# EAGLE design ETH-IO_v3.1 (EAGLE 9.6.2)
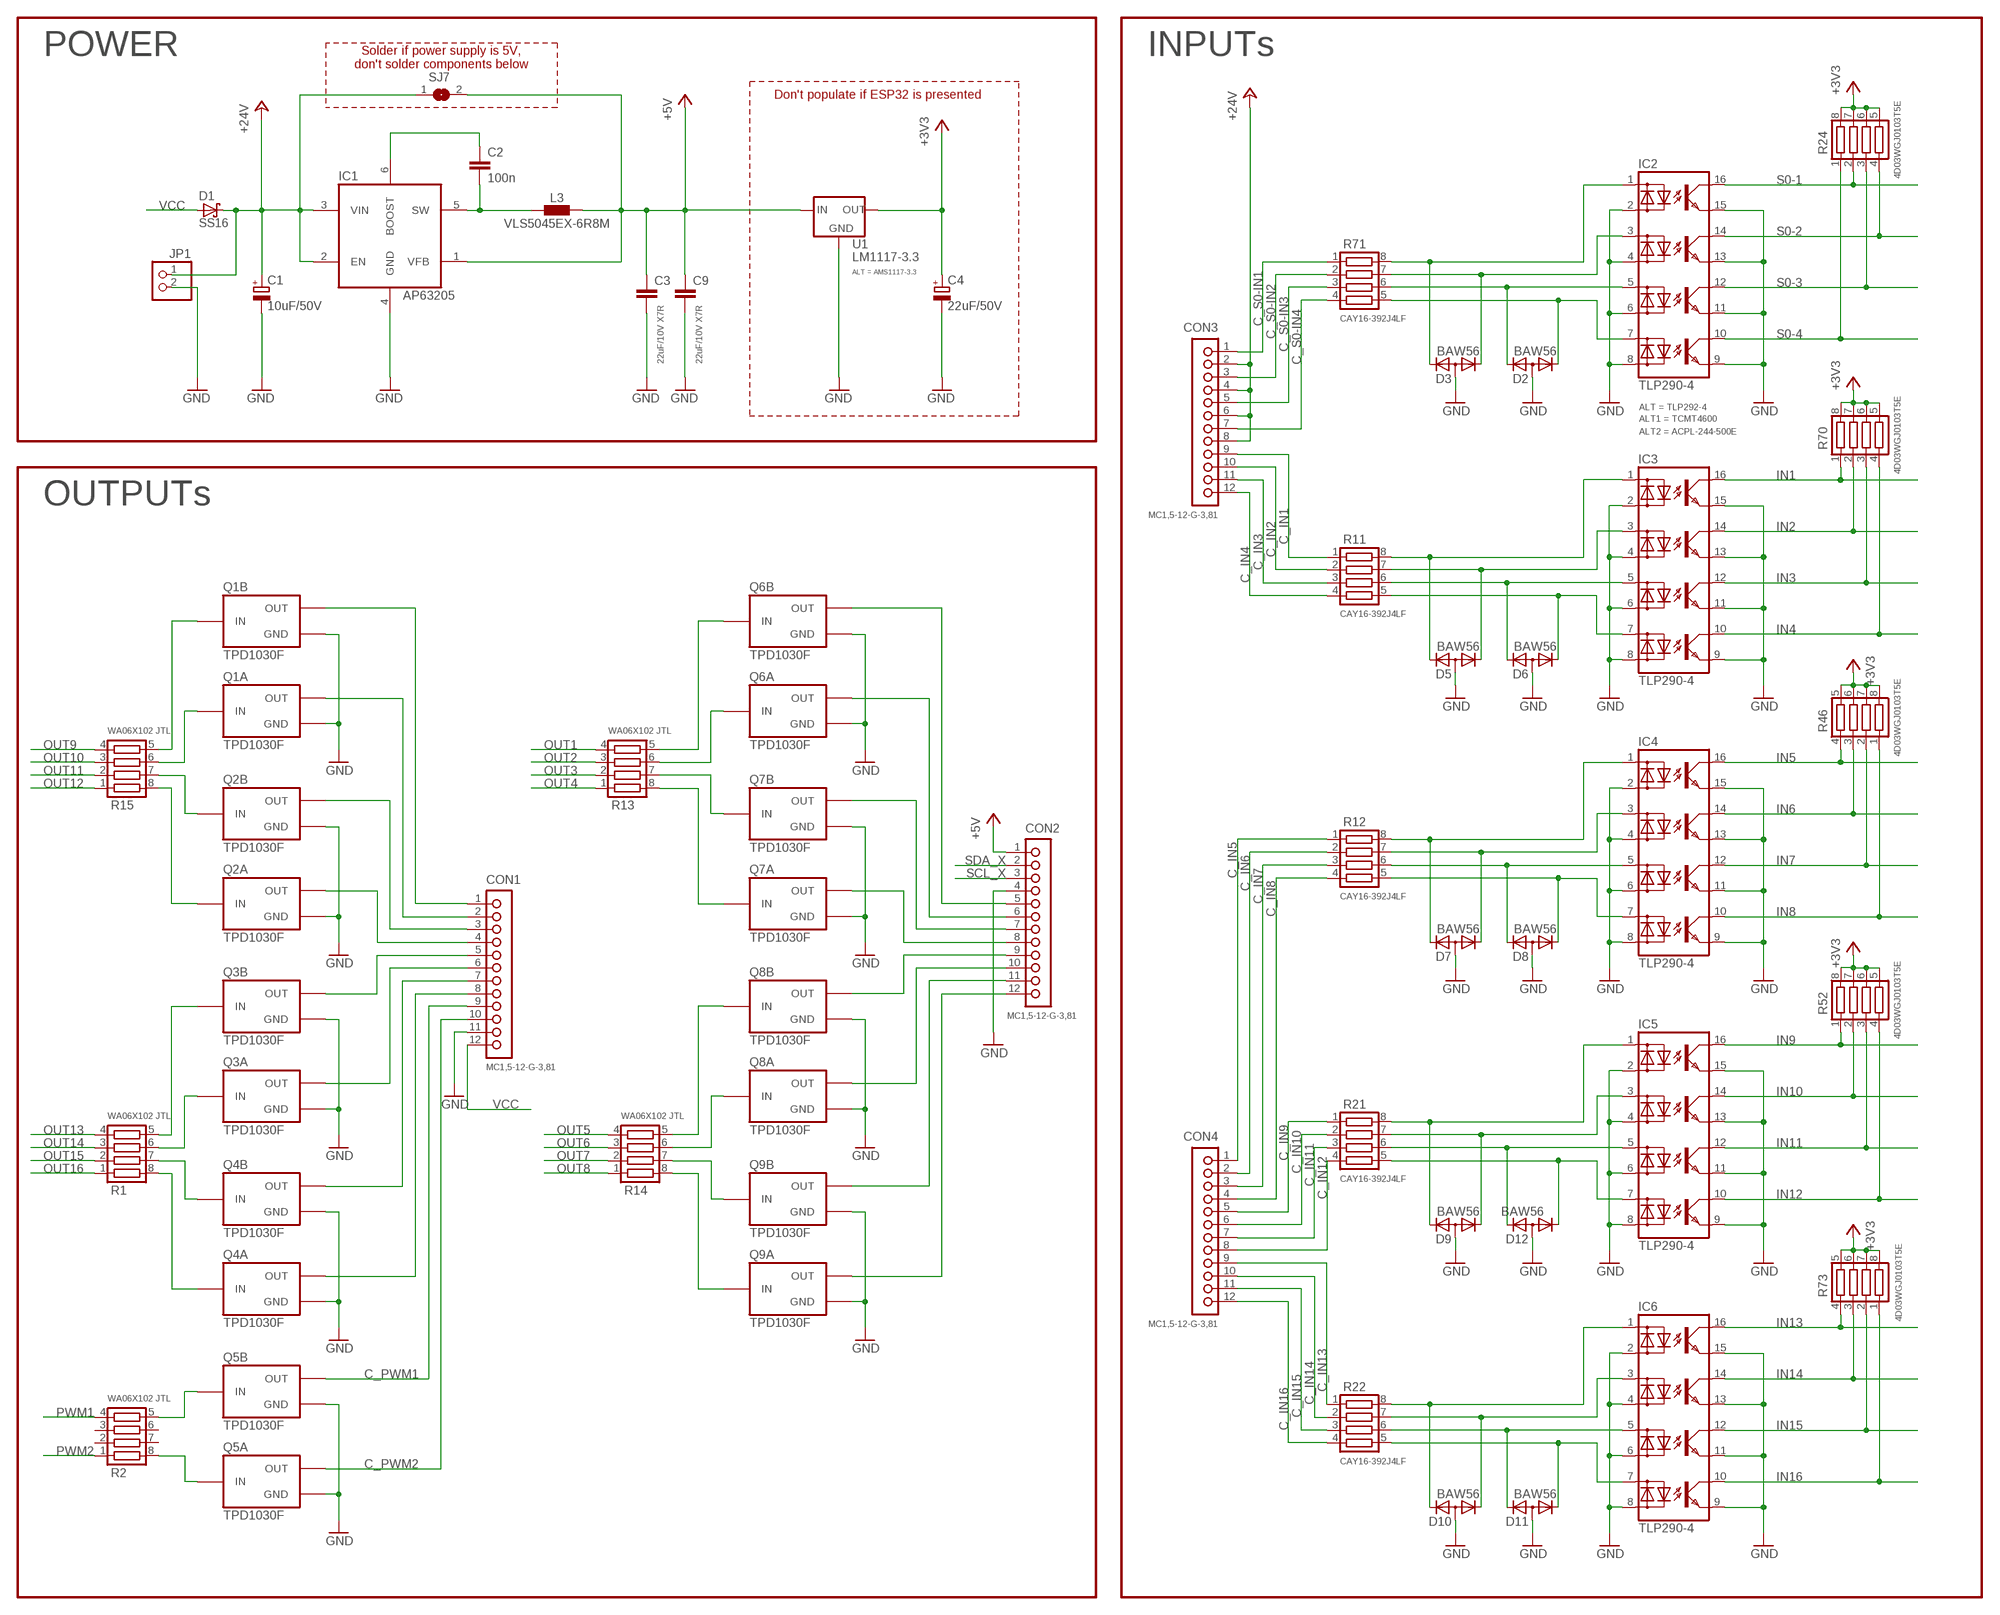
[diagram p0: schematic, sheet 1, part 1 of 2]
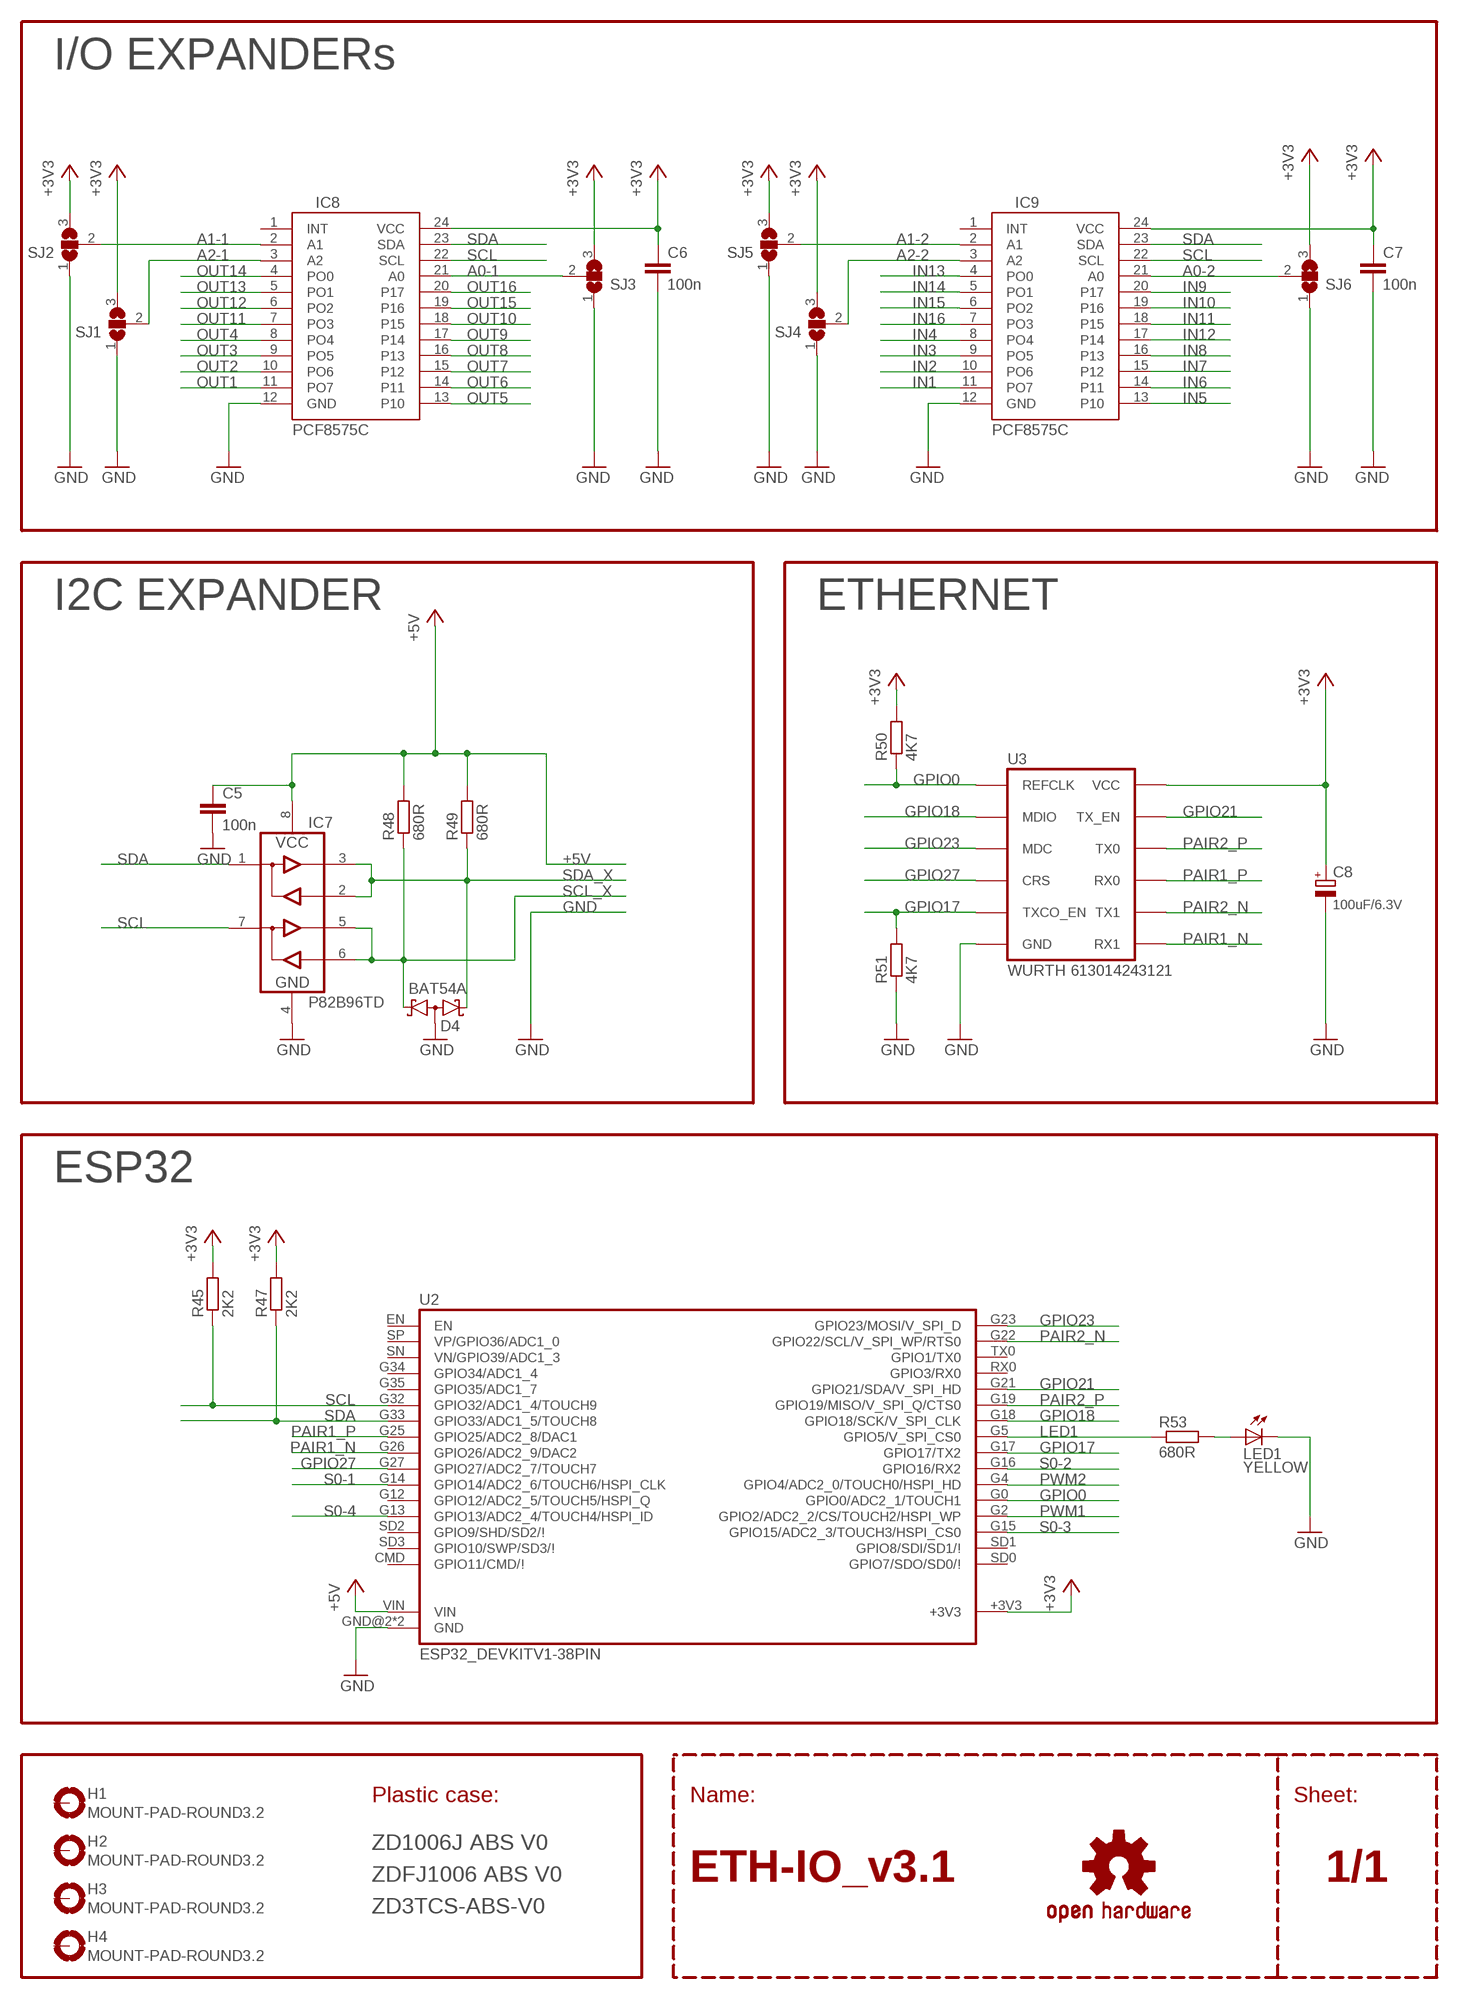
[diagram p1: schematic, sheet 1, part 2 of 2]

## Parts
C1  10uF/50V  CPOL-EUC  [PANASONIC_C]
C2  100n  C-EUC0805  [C0805]
C3  22uF/10V X7R  C-EUC1206  [C1206]
C4  22uF/50V  CPOL-EUC  [PANASONIC_C]
C5  100n  C-EUC0805  [C0805]
C6  100n  C-EUC0805  [C0805]
C7  100n  C-EUC0805  [C0805]
C8  100uF/6.3V  CPOL-EUC  [PANASONIC_C]
C9  22uF/10V X7R  C-EUC1206  [C1206]
CON1  MC1,5-12-G-3,81  [MC1,5/12-G-3,81]
CON2  MC1,5-12-G-3,81  [MC1,5/12-G-3,81]
CON3  MC1,5-12-G-3,81  [MC1,5/12-G-3,81]
CON4  MC1,5-12-G-3,81  [MC1,5/12-G-3,81]
D1  SS16  [DO214AC]
D2  BAW56  [SOT23]
D3  BAW56  [SOT23]
D4  BAT54A  [SOT23]
D5  BAW56  [SOT23]
D6  BAW56  [SOT23]
D7  BAW56  [SOT23]
D8  BAW56  [SOT23]
D9  BAW56  [SOT23]
D10  BAW56  [SOT23]
D11  BAW56  [SOT23]
D12  BAW56  [SOT23]
H1  MOUNT-PAD-ROUND3.2  [3,2-PAD]
H2  MOUNT-PAD-ROUND3.2  [3,2-PAD]
H3  MOUNT-PAD-ROUND3.2  [3,2-PAD]
H4  MOUNT-PAD-ROUND3.2  [3,2-PAD]
IC1  AP63205  [SOT23-6]
IC2  TLP290-4  [SO16]
IC3  TLP290-4  [SO16]
IC4  TLP290-4  [SO16]
IC5  TLP290-4  [SO16]
IC6  TLP290-4  [SO16]
IC7  P82B96TD  [SO08]
IC8  PCF8575C  [SO-24DW]
IC9  PCF8575C  [SO-24DW]
JP1  PINHD-1X2  [1X02]
L3  VLS5045EX-6R8M  L5045  [L5040-LONGER]
LED1  YELLOW  LED0805  [LED0805]
LOGO1  OSHW-LOGOM-COPPER  [OSHW-LOGO-M_COPPER]
Q1  TPD1030F  BTS3410G  [SO8]
Q2  TPD1030F  BTS3410G  [SO8]
Q3  TPD1030F  BTS3410G  [SO8]
Q4  TPD1030F  BTS3410G  [SO8]
Q5  TPD1030F  BTS3410G  [SO8]
Q6  TPD1030F  BTS3410G  [SO8]
Q7  TPD1030F  BTS3410G  [SO8]
Q8  TPD1030F  BTS3410G  [SO8]
Q9  TPD1030F  BTS3410G  [SO8]
R1  WA06X102 JTL  RESISTOR-ARRAY-1206  [RESCAV80P320X160X60-8N]
R2  WA06X102 JTL  RESISTOR-ARRAY-1206  [RESCAV80P320X160X60-8N]
R11  CAY16-392J4LF  RESISTOR-ARRAY-1206  [RESCAV80P320X160X60-8N]
R12  CAY16-392J4LF  RESISTOR-ARRAY-1206  [RESCAV80P320X160X60-8N]
R13  WA06X102 JTL  RESISTOR-ARRAY-1206  [RESCAV80P320X160X60-8N]
R14  WA06X102 JTL  RESISTOR-ARRAY-1206  [RESCAV80P320X160X60-8N]
R15  WA06X102 JTL  RESISTOR-ARRAY-1206  [RESCAV80P320X160X60-8N]
R21  CAY16-392J4LF  RESISTOR-ARRAY-1206  [RESCAV80P320X160X60-8N]
R22  CAY16-392J4LF  RESISTOR-ARRAY-1206  [RESCAV80P320X160X60-8N]
R24  4D03WGJ0103T5E  RESISTOR-ARRAY-1206  [RESCAV80P320X160X60-8N]
R45  2K2  R-EU_R0805  [R0805]
R46  4D03WGJ0103T5E  RESISTOR-ARRAY-1206  [RESCAV80P320X160X60-8N]
R47  2K2  R-EU_R0805  [R0805]
R48  680R  R-EU_R0805  [R0805]
R49  680R  R-EU_R0805  [R0805]
R50  4K7  R-EU_R0805  [R0805]
R51  4K7  R-EU_R0805  [R0805]
R52  4D03WGJ0103T5E  RESISTOR-ARRAY-1206  [RESCAV80P320X160X60-8N]
R53  680R  R-EU_R0805  [R0805]
R70  4D03WGJ0103T5E  RESISTOR-ARRAY-1206  [RESCAV80P320X160X60-8N]
R71  CAY16-392J4LF  RESISTOR-ARRAY-1206  [RESCAV80P320X160X60-8N]
R73  4D03WGJ0103T5E  RESISTOR-ARRAY-1206  [RESCAV80P320X160X60-8N]
SJ1  SJ2W  [SJ_2]
SJ2  SJ2W  [SJ_2]
SJ3  SJ2W  [SJ_2]
SJ4  SJ2W  [SJ_2]
SJ5  SJ2W  [SJ_2]
SJ6  SJ2W  [SJ_2]
SJ7  SJ  [SJ]
U1  LM1117-3.3  [SOT223]
U2  ESP32_DEVKITV1-38PIN  [ESP32_DEVKITV1_38PIN]
U3  WURTH 613014243121  LAN8720_ETH_BOARD  [LAN8720_ETH_BOARD]

## Nets
+3V3 [PWR]: C4.+ C6.1 C7.1 C8.+ IC8.24(VCC) IC9.24(VCC) R24.5 R24.6 R24.7 R24.8 R45.2 R46.5 R46.6 R46.7 R46.8 R47.2 R50.2 R52.5 R52.6 R52.7 R52.8 R70.5 R70.6 R70.7 R70.8 R73.5 R73.6 R73.7 R73.8 SJ1.3 SJ2.3 SJ3.3 SJ4.3 SJ5.3 SJ6.3 U1.2(OUT) U1.4(OUT) U2.+3V3 U3.VCC U3.VCC@1(VCC)
+5V [PWR]: C3.1 C5.1 C9.1 CON2.1 IC1.1(VFB) IC7.8(VCC) L3.1 R48.2 R49.2 SJ7.2 U1.3(IN) U2.VIN
+24V [PWR]: C1.+ CON3.2 CON3.4 CON3.6 CON3.8 D1.C IC1.2(EN) IC1.3(VIN) JP1.1 SJ7.1
A0-1: IC8.21(A0) SJ3.2
A0-2: IC9.21(A0) SJ6.2
A1-1: IC8.2(A1) SJ2.2
A1-2: IC9.2(A1) SJ5.2
A2-1: IC8.3(A2) SJ1.2
A2-2: IC9.3(A2) SJ4.2
C_IN1: CON3.9 R11.1
C_IN2: CON3.10 R11.2
C_IN3: CON3.11 R11.3
C_IN4: CON3.12 R11.4
C_IN5: CON4.1 R12.1
C_IN6: CON4.2 R12.2
C_IN7: CON4.3 R12.3
C_IN8: CON4.4 R12.4
C_IN9: CON4.5 R21.1
C_IN10: CON4.6 R21.2
C_IN11: CON4.7 R21.3
C_IN12: CON4.8 R21.4
C_IN13: CON4.9 R22.1
C_IN14: CON4.10 R22.2
C_IN15: CON4.11 R22.3
C_IN16: CON4.12 R22.4
C_OUT1: CON2.5 Q6.5(B:OUT) Q6.6(B:OUT)
C_OUT2: CON2.6 Q6.7(A:OUT) Q6.8(A:OUT)
C_OUT3: CON2.7 Q7.5(B:OUT) Q7.6(B:OUT)
C_OUT4: CON2.8 Q7.7(A:OUT) Q7.8(A:OUT)
C_OUT5: CON2.9 Q8.5(B:OUT) Q8.6(B:OUT)
C_OUT6: CON2.10 Q8.7(A:OUT) Q8.8(A:OUT)
C_OUT7: CON2.11 Q9.5(B:OUT) Q9.6(B:OUT)
C_OUT8: CON2.12 Q9.7(A:OUT) Q9.8(A:OUT)
C_OUT9: CON1.1 Q1.5(B:OUT) Q1.6(B:OUT)
C_OUT10: CON1.2 Q1.7(A:OUT) Q1.8(A:OUT)
C_OUT11: CON1.3 Q2.5(B:OUT) Q2.6(B:OUT)
C_OUT12: CON1.4 Q2.7(A:OUT) Q2.8(A:OUT)
C_OUT13: CON1.5 Q3.5(B:OUT) Q3.6(B:OUT)
C_OUT14: CON1.6 Q3.7(A:OUT) Q3.8(A:OUT)
C_OUT15: CON1.7 Q4.5(B:OUT) Q4.6(B:OUT)
C_OUT16: CON1.8 Q4.7(A:OUT) Q4.8(A:OUT)
C_PWM1: CON1.9 Q5.5(B:OUT) Q5.6(B:OUT)
C_PWM2: CON1.10 Q5.7(A:OUT) Q5.8(A:OUT)
C_S0-IN1: CON3.1 R71.1
C_S0-IN2: CON3.3 R71.2
C_S0-IN3: CON3.5 R71.3
C_S0-IN4: CON3.7 R71.4
GND [PWR]: C1.- C3.2 C4.- C5.2 C6.2 C7.2 C8.- C9.2 CON1.11 CON2.4 D2.3(A) D3.3(A) D4.3(AA) D5.3(A) D6.3(A) D7.3(A) D8.3(A) D9.3(A) D10.3(A) D11.3(A) D12.3(A) IC1.4(GND) IC2.2(C1) IC2.4(C2) IC2.6(C3) IC2.8(C4) IC2.9(EMIT4) IC2.11(EMIT3) IC2.13(EMIT2) IC2.15(EMIT1) IC3.2(C1) IC3.4(C2) IC3.6(C3) IC3.8(C4) IC3.9(EMIT4) IC3.11(EMIT3) IC3.13(EMIT2) IC3.15(EMIT1) IC4.2(C1) IC4.4(C2) IC4.6(C3) IC4.8(C4) IC4.9(EMIT4) IC4.11(EMIT3) IC4.13(EMIT2) IC4.15(EMIT1) IC5.2(C1) IC5.4(C2) IC5.6(C3) IC5.8(C4) IC5.9(EMIT4) IC5.11(EMIT3) IC5.13(EMIT2) IC5.15(EMIT1) IC6.2(C1) IC6.4(C2) IC6.6(C3) IC6.8(C4) IC6.9(EMIT4) IC6.11(EMIT3) IC6.13(EMIT2) IC6.15(EMIT1) IC7.4(GND) IC8.12(GND) IC9.12(GND) JP1.2 LED1.C Q1.1(A:GND) Q1.3(B:GND) Q2.1(A:GND) Q2.3(B:GND) Q3.1(A:GND) Q3.3(B:GND) Q4.1(A:GND) Q4.3(B:GND) Q5.1(A:GND) Q5.3(B:GND) Q6.1(A:GND) Q6.3(B:GND) Q7.1(A:GND) Q7.3(B:GND) Q8.1(A:GND) Q8.3(B:GND) Q9.1(A:GND) Q9.3(B:GND) R51.1 SJ1.1 SJ2.1 SJ3.1 SJ4.1 SJ5.1 SJ6.1 U1.1(GND) U2.GND@2(GND) U2.GND@3(GND) U3.GND U3.GND@1(GND)
GPIO0: R50.1 U2.G0(GPIO0/ADC2_1/TOUCH1) U3.INT(REFCLK)
GPIO17 [ETH]: R51.2 U2.G17(GPIO17/TX2) U3.TXCO_EN
GPIO18 [ETH]: U2.G18(GPIO18/SCK/V_SPI_CLK) U3.MDIO
GPIO21 [ETH]: U2.G21(GPIO21/SDA/V_SPI_HD) U3.TX_EN
GPIO23 [ETH]: U2.G23(GPIO23/MOSI/V_SPI_D) U3.MDC
GPIO27 [ETH]: U2.G27(GPIO27/ADC2_7/TOUCH7) U3.CRS
IN1: IC3.16(COL1) IC9.11(PO7) R70.1
IN2: IC3.14(COL2) IC9.10(PO6) R70.2
IN3: IC3.12(COL3) IC9.9(PO5) R70.3
IN4: IC3.10(COL4) IC9.8(PO4) R70.4
IN5: IC4.16(COL1) IC9.13(P10) R46.4
IN6: IC4.14(COL2) IC9.14(P11) R46.3
IN7: IC4.12(COL3) IC9.15(P12) R46.2
IN8: IC4.10(COL4) IC9.16(P13) R46.1
IN9: IC5.16(COL1) IC9.20(P17) R52.1
IN10: IC5.14(COL2) IC9.19(P16) R52.2
IN11: IC5.12(COL3) IC9.18(P15) R52.3
IN12: IC5.10(COL4) IC9.17(P14) R52.4
IN13: IC6.16(COL1) IC9.4(PO0) R73.4
IN14: IC6.14(COL2) IC9.5(PO1) R73.3
IN15: IC6.12(COL3) IC9.6(PO2) R73.2
IN16: IC6.10(COL4) IC9.7(PO3) R73.1
LED1: R53.1 U2.G5(GPIO5/V_SPI_CS0)
LED_RED: LED1.A R53.2
N$1: D3.2(K2) IC2.1(A1) R71.8
N$2: D3.1(K1) IC2.3(A2) R71.7
N$3: Q1.2(A:IN) R15.6
N$4: Q1.4(B:IN) R15.5
N$5: D2.2(K2) IC2.5(A3) R71.6
N$6: D2.1(K1) IC2.7(A4) R71.5
N$7: D5.2(K2) IC3.1(A1) R11.8
N$8: Q5.4(B:IN) R2.5
N$9: Q5.2(A:IN) R2.8
N$10: D6.1(K1) IC3.7(A4) R11.5
N$11: D5.1(K1) IC3.3(A2) R11.7
N$12: D6.2(K2) IC3.5(A3) R11.6
N$13: D7.2(K2) IC4.1(A1) R12.8
N$14: D7.1(K1) IC4.3(A2) R12.7
N$15: D8.2(K2) IC4.5(A3) R12.6
N$16: D8.1(K1) IC4.7(A4) R12.5
N$17: D12.2(K2) IC5.5(A3) R21.6
N$18: D12.1(K1) IC5.7(A4) R21.5
N$19: D9.1(K1) IC5.3(A2) R21.7
N$20: D9.2(K2) IC5.1(A1) R21.8
N$21: D11.2(K2) IC6.5(A3) R22.6
N$22: D11.1(K1) IC6.7(A4) R22.5
N$23: D10.1(K1) IC6.3(A2) R22.7
N$24: D10.2(K2) IC6.1(A1) R22.8
N$28: Q2.4(B:IN) R15.7
N$29: Q2.2(A:IN) R15.8
N$32: Q3.4(B:IN) R1.5
N$33: Q3.2(A:IN) R1.6
N$36: Q4.4(B:IN) R1.7
N$37: Q4.2(A:IN) R1.8
N$40: Q6.4(B:IN) R13.5
N$41: Q6.2(A:IN) R13.6
N$44: Q7.4(B:IN) R13.7
N$45: Q7.2(A:IN) R13.8
N$48: Q8.4(B:IN) R14.5
N$49: Q8.2(A:IN) R14.6
N$52: Q9.4(B:IN) R14.7
N$53: Q9.2(A:IN) R14.8
N$67: C2.2 IC1.5(SW) L3.2
N$68: C2.1 IC1.6(BOOST)
OUT1: IC8.11(PO7) R13.4
OUT2: IC8.10(PO6) R13.3
OUT3: IC8.9(PO5) R13.2
OUT4: IC8.8(PO4) R13.1
OUT5: IC8.13(P10) R14.4
OUT6: IC8.14(P11) R14.3
OUT7: IC8.15(P12) R14.2
OUT8: IC8.16(P13) R14.1
OUT9: IC8.17(P14) R15.4
OUT10: IC8.18(P15) R15.3
OUT11: IC8.7(PO3) R15.2
OUT12: IC8.6(PO2) R15.1
OUT13: IC8.5(PO1) R1.4
OUT14: IC8.4(PO0) R1.3
OUT15: IC8.19(P16) R1.2
OUT16: IC8.20(P17) R1.1
PAIR1_N [RMII-RX]: U2.G26(GPIO26/ADC2_9/DAC2) U3.RX1
PAIR1_P [RMII-RX]: U2.G25(GPIO25/ADC2_8/DAC1) U3.RX0
PAIR2_N [RMII-TX]: U2.G22(GPIO22/SCL/V_SPI_WP/RTS0) U3.TX1
PAIR2_P [RMII-TX]: U2.G19(GPIO19/MISO/V_SPI_Q/CTS0) U3.TX0
PWM1: R2.4 U2.G2(GPIO2/ADC2_2/CS/TOUCH2/HSPI_WP)
PWM2: R2.1 U2.G4(GPIO4/ADC2_0/TOUCH0/HSPI_HD)
S0-1: IC2.16(COL1) R24.2 U2.G14(GPIO14/ADC2_6/TOUCH6/HSPI_CLK)
S0-2: IC2.14(COL2) R24.4 U2.G16(GPIO16/RX2)
S0-3: IC2.12(COL3) R24.3 U2.G15(GPIO15/ADC2_3/TOUCH3/HSPI_CS0)
S0-4: IC2.10(COL4) R24.1 U2.G13(GPIO13/ADC2_4/TOUCH4/HSPI_ID)
SCL [I2C]: IC7.7(SY) IC8.22(SCL) IC9.22(SCL) R45.1 U2.G32(GPIO32/ADC1_4/TOUCH9)
SCL_X [I2C_DIFF]: CON2.3 D4.1(K1) IC7.5(TY) IC7.6(RY) R48.1
SDA [I2C]: IC7.1(SX) IC8.23(SDA) IC9.23(SDA) R47.1 U2.G33(GPIO33/ADC1_5/TOUCH8)
SDA_X [I2C_DIFF]: CON2.2 D4.2(K2) IC7.2(RX) IC7.3(TX) R49.1
VCC: CON1.12 D1.A
Unconnected: H1.B3,2(MOUNT) H2.B3,2(MOUNT) H3.B3,2(MOUNT) H4.B3,2(MOUNT) IC8.1(INT) IC9.1(INT) R2.2 R2.3 R2.6 R2.7 U2.CMD(GPIO11/CMD/!) U2.EN U2.G12(GPIO12/ADC2_5/TOUCH5/HSPI_Q) U2.G34(GPIO34/ADC1_4) U2.G35(GPIO35/ADC1_7) U2.RX0(GPIO3/RX0) U2.SD0(GPIO7/SDO/SD0/!) U2.SD1(GPIO8/SDI/SD1/!) U2.SD2(GPIO9/SHD/SD2/!) U2.SD3(GPIO10/SWP/SD3/!) U2.SN(VN/GPIO39/ADC1_3) U2.SP(VP/GPIO36/ADC1_0) U2.TX0(GPIO1/TX0)

## Notes on the sheet
- POWER | INPUTs | I/O EXPANDERs
- Solder if power supply is 5V,
  don't solder components below
- Don't populate if ESP32 is presented
- I2C EXPANDER | ETHERNET
- OUTPUTs
- ESP32
- Plastic case: | Name: | Sheet:
- ZD1006J ABS V0
- ZDFJ1006 ABS V0 | ETH-IO_v3.1
- ZD3TCS-ABS-V0

## Library data of the parts
C1 C4 C8 = rcl:CPOL-EU: POLARIZED CAPACITOR, European symbol; SPICEPREFIX: C
C2 C3 C5-C7 C9 = rcl:C-EU: CAPACITOR, European symbol; SPICEPREFIX: C
CON1-CON4 = my-con-terminal:MC1,5-12-G-?: 12P PCB plug-in terminal
D1 = my-diode:SS?*: Schottky Barrier Rectifier; A: 1; V: 60
D2 D3 D5-D12 = my-diode:BAW56
D4 = diode:BAT54A: Schottky Diodes Source: Fairchild .. BAT54.pdf
H1-H4 = holes:MOUNT-PAD-ROUND: MOUNTING PAD, round
IC1 = my-power:AP6320*: 2A LOW IQ SYNCHRONOUS BUCK; FREQ: 1.1MHz; MODE: PFM; OUTPUT: 5V
IC2 = my-opto:TLP290-4: Quad Channel Optocoupler with diode; ALT: TLP292-4; ALT1: TCMT4600; ALT2: ACPL-244-500E; LCSC: C39031
IC3-IC6 = my-opto:TLP290-4: Quad Channel Optocoupler with diode; LCSC: C39031
IC7 = my-ic:P82B96?: Dual bidirectional bus buffer; MSL: 1
IC8 IC9 = SparkFun-DigitalIC:PCF8575C: PCF8575C I/O Expander.
JP1 = pinhead:PINHD-1X2: PIN HEADER
L3 = my-inductor:L?: Inductor
LED1 = my-opto:LED
LOGO1 = SparkFun-Aesthetics:OSHW-LOGO: Open-Source Hardware (OSHW) Logo This logo indicates the piece of hardware it is found on incorporates a OSHW license and/or adheres to the definition of open source hardware found here: http://freedomdefined.org/OSHW
Q1-Q9 = my-load-switch:BTS3410G: Smart Low Side Power Switch
R1 R2 R11-R15 R21 R22 R24 R46 R52 R70 R71 R73 = my-rcl:RESISTOR-ARRAY-?
R45 R47-R51 R53 = rcl:R-EU_: RESISTOR, European symbol; SPICEPREFIX: R
SJ1-SJ6 = jumper:SJ2W: SMD solder JUMPER
SJ7 = jumper:SJ: SMD solder JUMPER
U1 = my-power:LM1117-*: LDO regulator; ALT: AMS1117-3.3
U2 = tmp:ESP32_DEVKITV1-38PIN
U3 = my-modules:LAN8720_ETH_BOARD

## Net classes
0 default: width 0.254 mm, drill 0.5 mm
1 ETH: width 0.254 mm, drill 0.35 mm
2 RMII-TX: width 0.254 mm, drill 0.35 mm
3 RMII-RX: width 0.254 mm, drill 0.35 mm
4 I2C: width 0.254 mm, drill 0.35 mm
5 PWR: width 0.305 mm, drill 0.5 mm
6 I2C_DIFF: width 0.254 mm, drill 0.5 mm

## Board
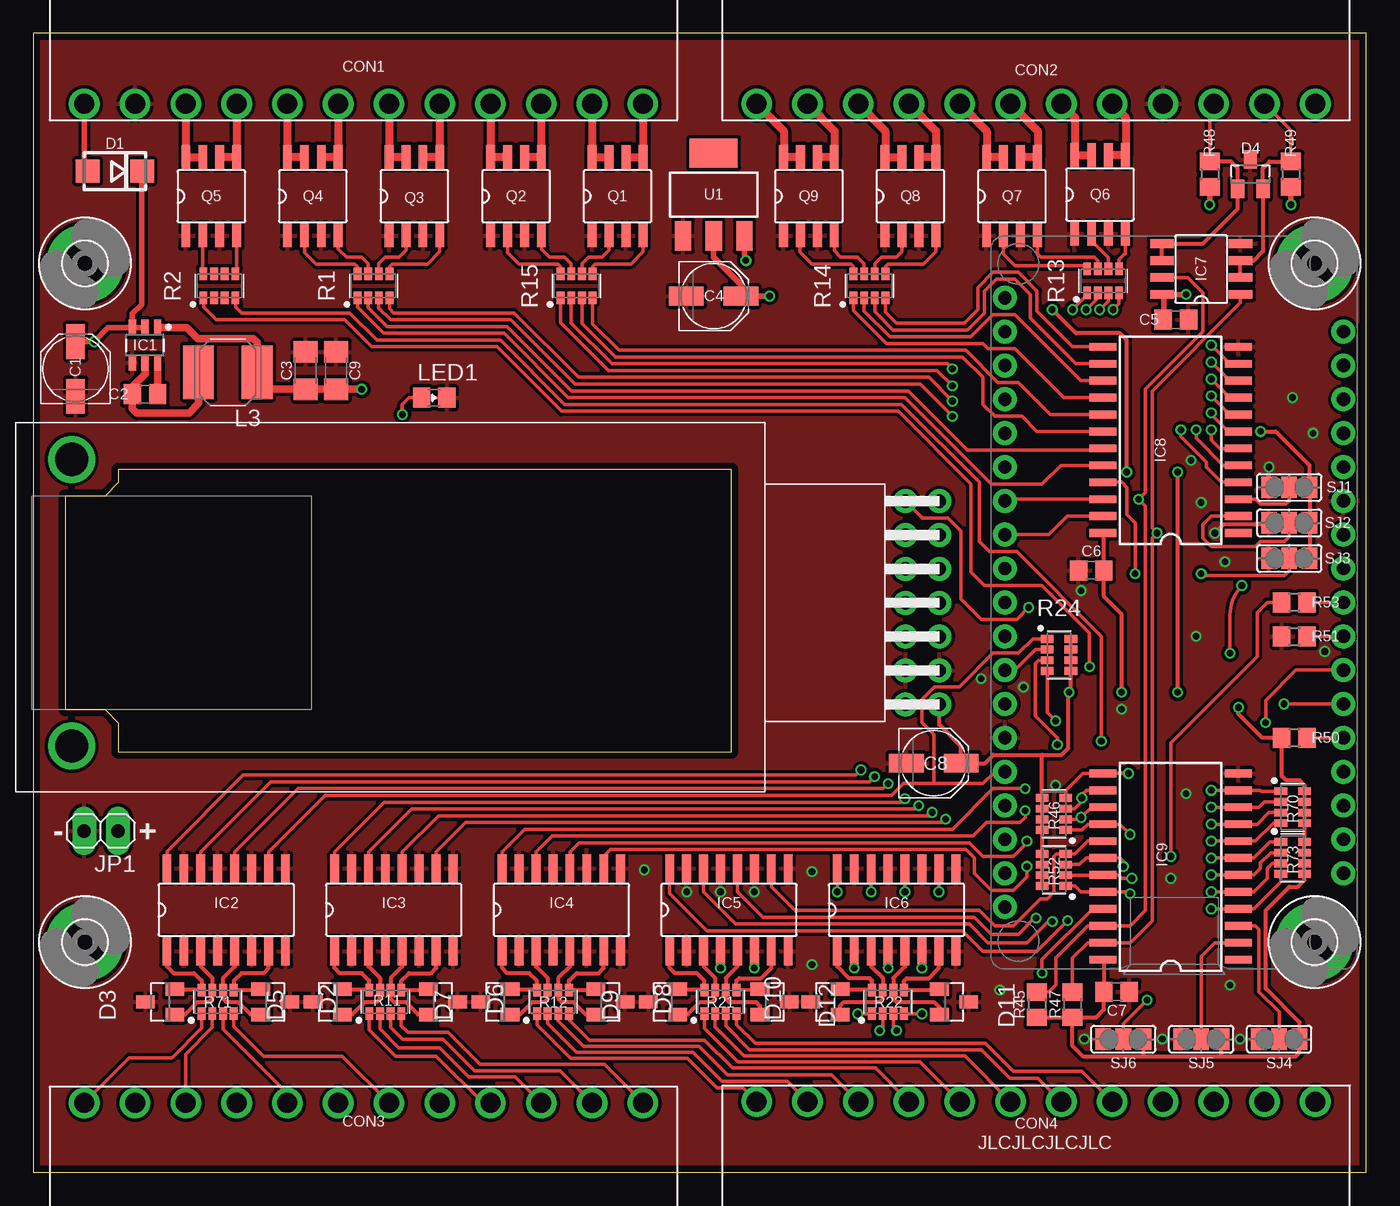
[diagram p2: board, top side]
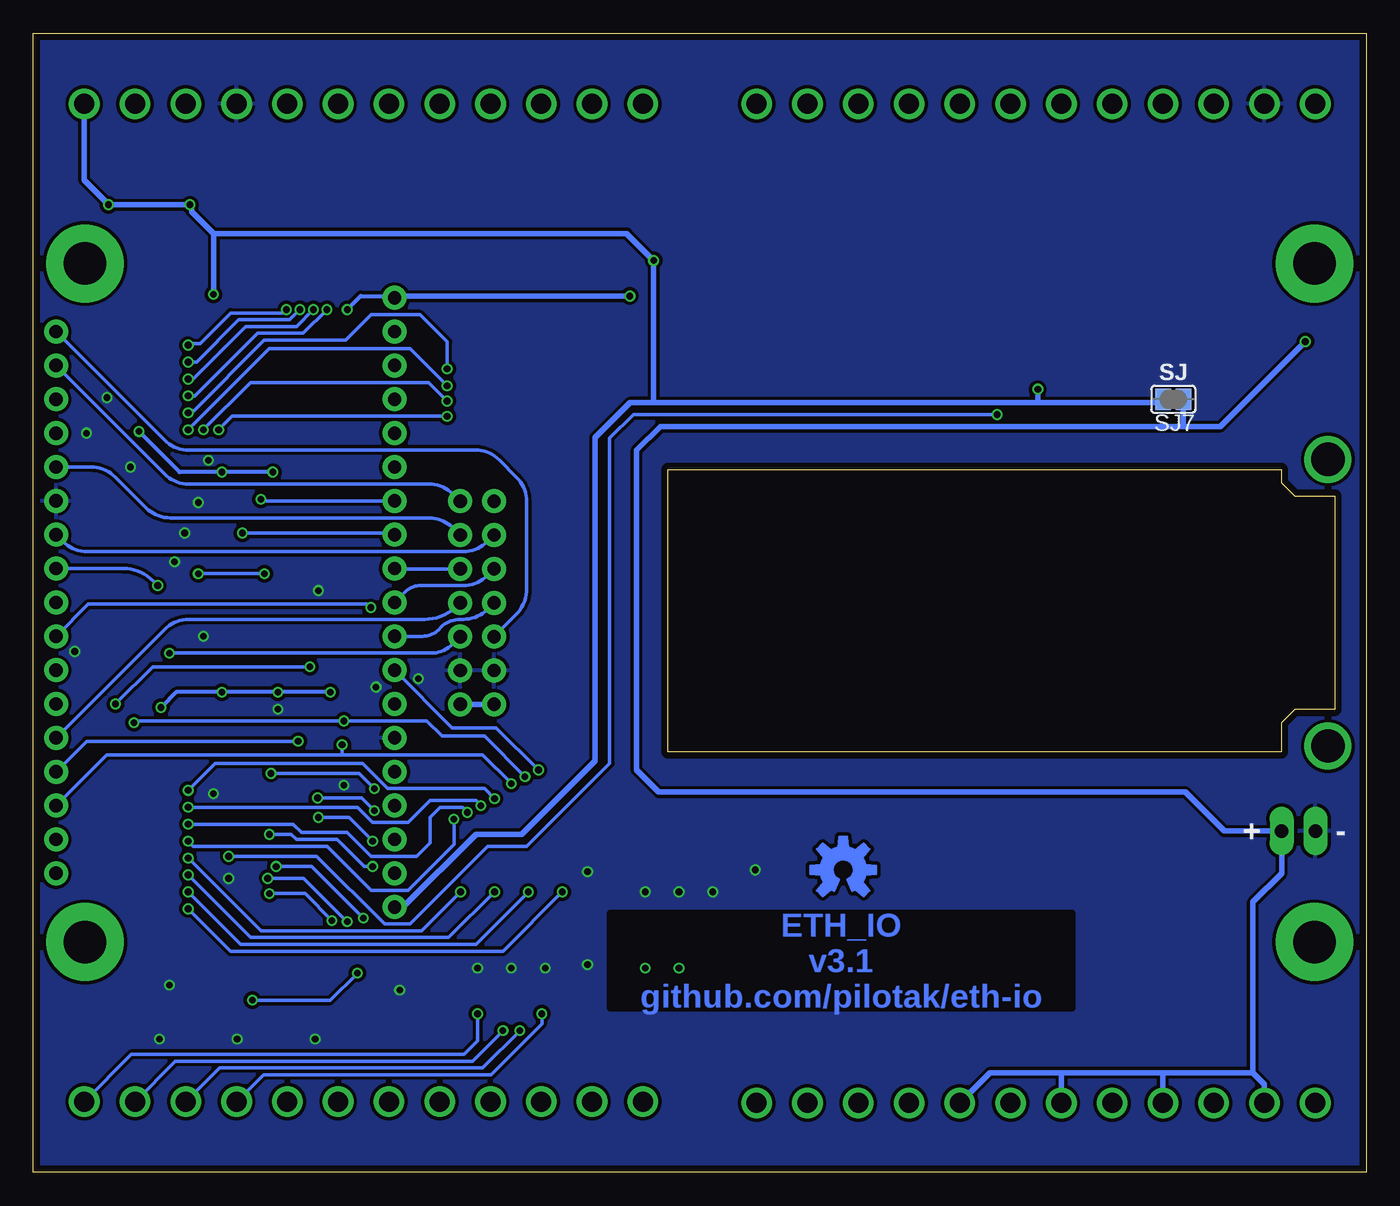
[diagram p3: board, bottom side, seen from below]

Size 100 x 85.45 mm. Coordinates in mm from the lower left corner, seen from the top.
Outline: 0,85.45 0,0 100,0 100,85.45 0,85.45
Copper layers (1*16): Top 0.035mm / dielectric 1.6mm / Bottom 0.035mm
Design rules "Elecrow_2-layer_optimal_PCB_eagle_rule *": minimum track width 6mil, minimum drill 12mil, track to track 6mil, track to pad 6mil, pad to pad 6mil, via to via 8mil, smd to smd 0mil, copper to edge 20mil, drill to drill 10mil, minimum pad ring 0.4mm, minimum via ring 6mil, stop-mask expansion 0mil, vias tented up to drill 100mil, thermal gap 10mil

### Footprints (pad centres in the part's own frame; a part is rotated, then mirrored left to right if it is on the bottom)
PANASONIC_C = smd 2.6 x 1.4: + 2.05,0; - -2.05,0
C0805 = smd 1.3 x 1.5: 1 -0.95,0; 2 0.95,0
C1206 = smd 1.6 x 1.8: 1 -1.4,0; 2 1.4,0
MC1,5/12-G-3,81 = drill 1.5: 1 -20.955,8; 2 -17.145,8; 3 -13.335,8; 4 -9.525,8; 5 -5.715,8; 6 -1.905,8; 7 1.905,8; 8 5.715,8; 9 9.525,8; 10 13.335,8; 11 17.145,8; 12 20.955,8
DO214AC = smd 1.8 x 1.7: A 2.05,0; C -2.05,0
SOT23 = smd 1 x 1.4: 1 -0.95,-1.1; 2 0.95,-1.1; 3 0,1.1
3,2-PAD = drill 3.2 pad 5.842: B3,2 0,0
SOT23-6 = smd 1.2 x 0.55: 1 -1.3,0.95; 2 -1.3,0; 3 -1.3,-0.95; 4 1.3,-0.95; 5 1.3,0; 6 1.3,0.95
SO16 = smd 0.66 x 2.1: 1 -4.445,-3.1; 2 -3.175,-3.1; 3 -1.905,-3.1; 4 -0.635,-3.1; 5 0.635,-3.1; 6 1.905,-3.1; 7 3.175,-3.1; 8 4.445,-3.1; 9 4.445,3.1; 10 3.175,3.1; 11 1.905,3.1; 12 0.635,3.1; 13 -0.635,3.1; 14 -1.905,3.1; 15 -3.175,3.1; 16 -4.445,3.1
SO08 = smd 0.66 x 1.778: 1 -1.905,-2.946; 2 -0.635,-2.946; 3 0.635,-2.946; 4 1.905,-2.946; 5 1.905,2.946; 6 0.635,2.946; 7 -0.635,2.946; 8 -1.905,2.946
SO-24DW = smd 0.584 x 2.032: 1 -6.35,-5.08; 2 -5.08,-5.08; 3 -3.81,-5.08; 4 -2.54,-5.08; 5 -1.27,-5.08; 6 0,-5.08; 7 1.27,-5.08; 8 2.54,-5.08; 9 3.81,-5.08; 10 5.08,-5.08; 11 6.35,-5.08; 12 7.62,-5.08; 13 7.62,5.08; 14 6.35,5.08; 15 5.08,5.08; 16 3.81,5.08; 17 2.54,5.08; 18 1.27,5.08; 19 0,5.08; 20 -1.27,5.08; 21 -2.54,5.08; 22 -3.81,5.08; 23 -5.08,5.08; 24 -6.35,5.08
1X02 = drill 1.016 long: 1 -1.27,0; 2 1.27,0
L5040-LONGER = smd 2.3 x 4: 1 -2.2,0; 2 2.2,0
LED0805 = smd 1.5 x 1.3: A 0,-0.95; C 0,0.95
SO8 = smd 0.66 x 1.778: 1 -1.905,-2.946; 2 -0.635,-2.946; 3 0.635,-2.946; 4 1.905,-2.946; 5 1.905,2.946; 6 0.635,2.946; 7 -0.635,2.946; 8 -1.905,2.946
RESCAV80P320X160X60-8N = smd 0.945 x 0.584: 1 -0.89,1.2; 2 -0.89,0.4; 3 -0.89,-0.4; 4 -0.89,-1.2; 5 0.89,-1.2; 6 0.89,-0.4; 7 0.89,0.4; 8 0.89,1.2
R0805 = smd 1.3 x 1.5: 1 -0.95,0; 2 0.95,0
SJ_2 = smd 1.168 x 1.6: 1 -1.524,0; 2 0,0; 3 1.524,0
SJ = smd 1.168 x 1.6: 1 -0.762,0; 2 0.762,0
SOT223 = smd 1.219 x 2.235: 1 -2.311,-3.099; 2 0,-3.099; 3 2.311,-3.099 | smd 3.6 x 2.2: 4 0,3.099
ESP32_DEVKITV1_38PIN = drill 1: +3V3 -12.7,22.86; CMD -12.7,-20.32; EN -12.7,20.32; G0 12.7,-10.16; G2 12.7,-12.7; G4 12.7,-7.62; G5 12.7,0; G12 -12.7,-7.62; G13 -12.7,-12.7; G14 -12.7,-5.08; G15 12.7,-15.24; G16 12.7,-5.08; G17 12.7,-2.54; G18 12.7,2.54; G19 12.7,5.08; G21 12.7,10.16; G22 12.7,17.78; G23 12.7,20.32; G25 -12.7,2.54; G26 -12.7,0; G27 -12.7,-2.54; G32 -12.7,7.62; G33 -12.7,5.08; G34 -12.7,12.7; G35 -12.7,10.16; GND@2 12.7,7.62; GND@3 -12.7,-10.16; RX0 12.7,12.7; SD0 12.7,-20.32; SD1 12.7,-17.78; SD2 -12.7,-15.24; SD3 -12.7,-17.78; SN -12.7,15.24; SP -12.7,17.78; TX0 12.7,15.24; VIN -12.7,-22.86
LAN8720_ETH_BOARD = drill 1: CRS 10.56,0; GND 13.1,-5.08; GND@1 10.56,-5.08; INT 13.1,0; MDC 10.56,-2.54; MDIO 13.1,-2.54; RX0 13.1,2.54; RX1 10.56,2.54; TX0 10.56,5.08; TX1 13.1,7.62; TX_EN 13.1,5.08; TXCO_EN 10.56,7.62; VCC 13.1,-7.62; VCC@1 10.56,-7.62 | drill 2.5: H3 -52,-10.75; H4 -52,10.75

### Placement (x,y rotation side)
C1  3.17,60.27 90 top
C2  8.38,58.37 180 top
C3  20.44,60.15 90 top
C4  51.05,65.73 0 top
C5  85.72,63.96 0 top
C6  79.37,45.16 180 top
C7  81.27,13.54 0 top
C8  67.56,30.68 0 top
C9  22.73,60.15 90 top
CON1  24.77,88.15 180 top
CON2  75.22,88.15 180 top
CON3  24.77,-2.8 0 top
CON4  75.22,-2.7 0 top
D1  6.12,75.11 180 top
D2  18.16,12.78 270 top
D3  9.52,12.78 90 top
D4  91.31,74.88 0 top
D5  22.09,12.78 90 top
D6  30.73,12.78 270 top
D7  34.66,12.78 90 top
D8  43.3,12.78 270 top
D9  47.24,12.78 90 top
D10  59.43,12.78 90 top
D11  69.08,12.78 270 top
D12  55.62,12.78 270 top
H1  3.88,17.28 0 top
H2  96.12,17.28 0 top
H3  96.12,68.17 0 top
H4  3.88,68.17 0 top
IC1  8.38,62.05 270 top
IC2  14.47,19.68 0 top
IC3  27.05,19.68 0 top
IC4  39.62,19.68 0 top
IC5  52.19,19.68 0 top
IC6  64.76,19.68 0 top
IC7  87.62,67.77 90 top
IC8  85.34,54.3 90 top
IC9  85.34,22.3 90 top
JP1  5.07,25.6 180 top
L3  14.6,60.02 180 top
LED1  30.07,58.1 270 top
LOGO1  39.24,22.68 0 bottom
Q1  43.83,73.23 0 top
Q2  36.21,73.23 0 top
Q3  28.59,73.23 0 top
Q4  20.97,73.23 0 top
Q5  13.35,73.23 0 top
Q6  80.03,73.35 0 top
Q7  73.43,73.23 0 top
Q8  65.81,73.23 0 top
Q9  58.19,73.23 0 top
R1  25.52,66.5 90 top
R2  13.96,66.5 90 top
R11  26.41,12.78 90 top
R12  38.98,12.78 90 top
R13  80.26,66.88 90 top
R14  62.73,66.5 90 top
R15  40.76,66.5 90 top
R21  51.56,12.78 90 top
R22  64.13,12.78 90 top
R24  76.96,38.81 0 top
R45  75.31,12.57 270 top
R46  76.58,26.87 180 top
R47  77.97,12.57 270 top
R48  88.26,74.88 270 top
R49  94.36,74.88 270 top
R50  94.61,32.59 180 top
R51  94.61,40.21 0 top
R52  76.58,22.68 180 top
R53  94.61,42.75 180 top
R70  94.48,27.38 0 top
R71  13.84,12.78 90 top
R73  94.48,23.57 0 top
SJ1  94.23,51.38 0 top
SJ2  94.23,48.72 0 top
SJ3  94.23,46.05 0 top
SJ4  93.47,9.98 0 top
SJ5  87.62,9.98 0 top
SJ6  81.78,9.98 0 top
SJ7  14.47,57.99 180 bottom
U1  51.05,73.35 0 top
U2  85.59,42.75 0 top
U3  54.88,42.73 0 top

### Tracks (layer width: path | path; a pad name or v marks a point on that pad's centre or on a via)
+3V3  (via drill 0.5)
  Top 0.305: 75.69,31.32 72.02,31.32 71.39,30.68 C8.+ 69.61,31.95 67.97,33.58 U3.VCC | 75.69,31.32 77.14,31.32 77.65,31.83 77.65,35.95 v77.72,36.02 77.85,36.15 R24.5 R24.6 R24.7 R24.8 | v82.04,52.53 82.04,62.43 81.53,62.94 78.23,62.94 v76.45,64.72 | v92.07,55.58 93.21,55.58 95.75,53.04 SJ1.3 SJ2.3 SJ3.3 | v85.85,52.53 v85.85,36.02 | IC9.24 80.32,15.88 C7.1 80.32,12.21 79.74,11.62 R47.2 | R45.2 R47.2 | R47.2 77.97,9.47 78.73,8.71 83.31,8.71 | 83.31,8.71 SJ6.3 | 83.31,8.71 89.15,8.71 | 89.15,8.71 SJ5.3 | 89.15,8.71 94.74,8.71 94.99,8.97 SJ4.3 94.99,11.25 92.45,13.79 92.45,19.63 94.23,21.41 94.86,21.41 95.37,21.92 R73.5 R73.6 R73.7 R73.8 R70.5 R70.6 R70.7 R70.8 95.37,29.03 94.99,29.41 93.97,29.41 93.66,29.73 R50.2 92.2,32.59 90.42,34.37 v90.42,34.87 | R52.8 R52.7 R52.6 R52.5 R46.8 R46.7 R46.6 R46.5 75.69,31.32 | IC8.24 80.32,47.89 80.32,47.88 C6.1 80.32,43.2 81.66,41.86 v81.66,36.02
  Top 0.406: U1.2 51.05,68.66 53.1,66.61 C4.+ v55.24,65.73
  Bottom 0.305: v76.45,64.72 75.43,65.73 72.89,65.73 | v82.04,52.53 v85.85,52.53 89.02,52.53 v92.07,55.58 | v77.72,36.02 v81.66,36.02 v85.85,36.02 89.28,36.02 v90.42,34.87
  Bottom 0.406: U2.+3V3 72.89,65.73 v55.24,65.73 | U3.VCC U3.VCC@1
+5V  (via drill 0.5)
  Top 0.406: v53.46,68.4 53.36,68.5 U1.3 | C5.1 84.83,63.9 84.83,65.71 IC7.8 v86.48,65.86 | R48.2 v88.26,72.59 | R49.2 v94.36,72.59
  Top 0.559: IC1.1 11.52,63.35 12.31,62.56 16.5,62.56 16.8,62.27 L3.1 16.8,58.75 C3.1 C9.1 v24.63,58.75
  Bottom 0.406: 53.46,57.73 v53.46,68.4 55.49,70.43 86.48,70.43 | U2.VIN 72.26,19.89 66.8,25.35 63.37,25.35 57.84,30.87 57.84,55.13 55.24,57.73 53.46,57.73 | 86.48,70.43 v86.48,65.86 | 86.48,70.43 88.13,72.08 88.13,72.47 v88.26,72.59 v94.36,72.59 96.18,74.42 CON2.1 | v24.63,58.75 24.63,57.73 | 53.46,57.73 24.63,57.73 | 24.63,57.73 15.49,57.73 SJ7.2
+24V  (via drill 0.5)
  Top 0.406: D1.C 8.12,75.06 8.12,65.1 7.43,64.4 IC1.3 | C1.+ v4.57,62.32 5.59,63.35 IC1.3 | IC1.2 IC1.3
  Bottom 0.406: CON3.4 15.25,7.45 | 8.5,7.45 8.5,20.27 6.34,22.43 JP1.1 10.66,25.6 13.58,28.52 53.08,28.52 54.73,30.18 54.73,54.18 52.95,55.96 13.71,55.96 | 8.5,7.45 15.25,7.45 | 8.5,7.45 7.63,6.58 CON3.2 | 13.71,55.96 10.93,55.96 v4.57,62.32 | 15.25,7.45 22.87,7.45 | 22.87,7.45 CON3.6 | 22.87,7.45 28.24,7.45 CON3.8 | SJ7.1 13.71,55.96
A0-1  (via drill 0.5)
  Top 0.254: SJ3.2 94.23,45.16 93.85,44.78 87.75,44.78 v87.62,44.91 | IC8.21 81.66,51.77 82.04,51.38 82.04,49.35 82.67,48.72 v82.67,44.91
  Bottom 0.254: v87.62,44.91 v82.67,44.91
A0-2  (via drill 0.5)
  Top 0.254: SJ6.2 81.78,11.12 v83.56,12.9 | v75.69,14.94 75.69,15.95 79.5,19.76 IC9.21
  Bottom 0.254: v83.56,12.9 77.72,12.9 v75.69,14.94
A1-1
  Top 0.254: SJ2.2 94.23,47.7 93.85,47.32 92.07,47.32 91.69,46.94 88.39,46.94 87.75,47.57 87.75,48.59 88.39,49.23 IC8.2
A1-2
  Top 0.254: SJ5.2 87.62,16.21 88.64,17.22 IC9.2
A2-1
  Top 0.254: SJ1.2 94.23,50.37 93.97,50.11 92.07,50.11 91.69,50.5 IC8.3
A2-2
  Top 0.254: SJ4.2 93.47,12.01 91.94,13.54 91.94,18.24 91.69,18.49 IC9.3
C_IN1
  Top 0.254: CON3.9 33.73,5.2 30.22,8.71 27.17,8.71 25.21,10.67 R11.1
C_IN2
  Top 0.254: CON3.10 36.15,7.16 32.66,7.16 30.47,9.35 27.41,9.35 26.01,10.74 R11.2
C_IN3
  Top 0.254: CON3.11 39.5,7.62 33.09,7.62 30.73,9.98 27.7,9.98 26.81,10.87 R11.3
C_IN4
  Top 0.254: CON3.12 42.85,8.08 33.52,8.08 31.11,10.49 28.12,10.49 27.61,11 R11.4
C_IN5
  Top 0.254: CON4.1 53.25,6.32 51.28,6.32 49.07,8.53 40.3,8.53 37.78,11.05 R12.1
C_IN6
  Top 0.254: CON4.2 56.57,6.81 51.68,6.81 49.5,8.99 40.76,8.99 38.58,11.17 R12.2
C_IN7
  Top 0.254: CON4.3 59.88,7.31 52.06,7.31 49.93,9.45 41.29,9.45 39.38,11.36 R12.3
C_IN8
  Top 0.254: CON4.4 63.18,7.82 52.45,7.82 50.36,9.91 41.73,9.91 40.18,11.45 R12.4
C_IN9
  Top 0.254: CON4.5 66.53,8.28 52.88,8.28 50.36,10.8 R21.1
C_IN10
  Top 0.254: CON4.6 69.88,8.74 53.31,8.74 51.16,10.89 R21.2
C_IN11
  Top 0.254: CON4.7 75.37,7.06 73.27,7.06 71.14,9.2 53.74,9.2 51.96,10.98 R21.3
C_IN12
  Top 0.254: CON4.8 78.67,7.57 73.53,7.57 71.44,9.65 54.17,9.65 52.76,11.07 R21.4
C_IN13  (via drill 0.5)
  Top 0.254: v61.84,11.89 R22.1
  Bottom 0.254: v61.84,11.89 61.84,11.12 65.65,7.31 82.73,7.31 CON4.9
C_IN14  (via drill 0.5)
  Top 0.254: v63.49,10.62 63.73,10.85 R22.2
  Bottom 0.254: v63.49,10.62 66.29,7.82 86.04,7.82 CON4.10
C_IN15  (via drill 0.5)
  Top 0.254: v64.76,10.62 64.53,10.85 R22.3
  Bottom 0.254: v64.76,10.62 67.05,8.33 89.34,8.33 CON4.11
C_IN16  (via drill 0.5)
  Top 0.254: v66.67,11.89 R22.4
  Bottom 0.254: v66.67,11.89 66.67,9.86 67.69,8.84 92.64,8.84 CON4.12
C_OUT1
  Top 0.61: Q6.6 Q6.5 81.96,76.32 81.96,79.13 CON2.5
C_OUT2
  Top 0.61: Q6.7 Q6.8 78.15,76.32 78.15,79.13 CON2.6
C_OUT3
  Top 0.61: Q7.6 Q7.5 75.35,76.2 75.35,78.12 CON2.7
C_OUT4
  Top 0.61: Q7.7 Q7.8 71.54,76.2 71.54,78.12 CON2.8
C_OUT5
  Top 0.61: Q8.6 Q8.5 67.73,76.2 67.73,78.12 CON2.9
C_OUT6
  Top 0.61: Q8.7 Q8.8 63.92,76.2 63.92,78.12 CON2.10
C_OUT7
  Top 0.61: Q9.6 Q9.5 60.11,76.2 60.11,78.12 CON2.11
C_OUT8
  Top 0.61: Q9.7 Q9.8 56.3,76.2 56.3,78.12 CON2.12
C_OUT9
  Top 0.61: Q1.6 Q1.5 45.73,76.18 CON1.1
C_OUT10
  Top 0.61: Q1.7 Q1.8 41.92,76.18 CON1.2
C_OUT11
  Top 0.61: Q2.6 Q2.5 38.11,76.18 CON1.3
C_OUT12
  Top 0.61: Q2.7 Q2.8 34.3,76.18 CON1.4
C_OUT13
  Top 0.61: Q3.6 Q3.5 30.49,76.18 CON1.5
C_OUT14
  Top 0.61: Q3.7 Q3.8 26.68,76.18 CON1.6
C_OUT15
  Top 0.61: Q4.6 Q4.5 22.87,76.18 CON1.7
C_OUT16
  Top 0.61: Q4.7 Q4.8 19.06,76.18 CON1.8
C_PWM1
  Top 0.61: Q5.6 Q5.5 15.25,76.18 CON1.9
C_PWM2
  Top 0.61: Q5.7 Q5.8 11.45,80.14 CON1.10
C_S0-IN1
  Top 0.254: CON3.1 7.21,8.59 10.41,8.59 12.64,10.81 R71.1
C_S0-IN2
  Top 0.254: CON3.3 11.44,8.86 13.44,10.85 R71.2
C_S0-IN3
  Top 0.254: CON3.5 19.06,5.9 14.24,10.72 R71.3
C_S0-IN4
  Top 0.254: R71.4 15.04,10.94 17.27,8.71 23.17,8.71 CON3.7
GND  (via drill 0.5)
  Top 0.305: SJ1.1 v92.7,52.91 | IC6.2 v61.59,15.32 | IC6.4 v64.13,15.32 | IC6.6 v66.67,15.32 | IC5.4 v51.56,15.32 | IC5.6 v54.1,15.32 | SJ2.1 92.58,48.59 89.28,48.59 v88.64,47.95
  other vias: 58.41,22.55 45.84,22.68 54.1,21.03 51.56,21.03 49.02,21.03 78.86,9.98 84.7,9.98 90.55,9.98 72.51,13.66 81.66,34.75 89.78,14.05 87.24,40.21 87.62,50.24 78.61,43.64 96.89,39.07 86.86,53.42 94.48,58.12 85.34,22.05 86.48,28.4 89.4,45.8 96.01,55.45 71.11,37.03 74.29,36.4 76.7,29.03 58.41,15.57
  cutout Bottom: 72.64,33.35 72.64,31.95 71.75,31.95 71.75,33.35
  pour Bottom (isolate 0.254): 0,85.45 0,0 100,0 100,85.45
  pour Top (isolate 0.254): 0,85.45 0,0 100,0 100,85.45
  cutout Top: 12.57,15.95 14.73,15.95 14.73,14.94 12.57,14.94 12.57,15.82
  cutout Top: 25.39,16.08 27.17,16.08 27.17,15.06 25.39,15.06
  cutout Top: 38.09,15.95 39.87,15.95 39.87,14.94 38.09,14.94
  cutout Top: 50.54,15.82 54.86,15.82 54.86,14.81 50.54,14.81
  cutout Top: 60.83,15.82 67.56,15.82 67.56,14.81 60.83,14.81
  cutout Top: 64.76,29.16 66.16,29.16 66.16,30.05 64.76,30.05
GPIO0
  Top 0.254: R50.1 U2.G0
  Bottom 0.254: U2.G0 90.15,40.73 arc45 88.35,41.48 70.66,41.48 arc-45 68.21,42.49 U3.INT
GPIO17  (via drill 0.5)
  Top 0.254: v74.67,42.37 73.78,41.48 71.11,41.48 69.59,43 69.59,48.1 68.62,49.08 66.7,49.08 U3.TXCO_EN | R51.2 U2.G17
  Bottom 0.254: v74.67,42.37 74.92,42.62 95.88,42.62 U2.G17
GPIO18  (via drill 0.5)
  Top 0.254: v89.78,38.94 89.78,41.82 arc-45 90.67,43.97 v90.67,44.02
  Bottom 0.254: v90.67,44.02 91.02,44.36 arc-45 93.25,45.29 U2.G18 | v89.78,38.94 70.2,38.94 arc-45 68.53,39.63 U3.MDIO
GPIO21
  Bottom 0.254: U2.G21 95.66,52.91 arc45 93.86,52.16 91.54,49.84 arc-45 89.75,49.1 70.32,49.1 arc45 68.52,48.35 U3.TX_EN
GPIO23
  Bottom 0.254: U2.G23 90.15,54.92 arc-45 88.35,54.18 66.83,54.18 arc45 65.04,53.43 63.73,52.13 arc45 62.99,50.33 62.99,43.8 arc45 63.81,41.81 U3.MDC
GPIO27
  Bottom 0.254: U2.G27 70.79,40.21 arc-45 69.61,40.7 69.4,40.9 arc45 68.01,41.48 67.73,41.48 arc-45 65.94,42.22 U3.CRS
IN1  (via drill 0.5)
  Top 0.254: IC3.16 22.6,24.03 26.33,27.76 65.14,27.76 v65.4,28.02 | v88.39,28.65 IC9.11 92.07,28.65 92.14,28.58 R70.1
  Bottom 0.254: v65.4,28.02 66.16,28.78 73.4,28.78 75.31,30.68 86.35,30.68 v88.39,28.65
IN2  (via drill 0.5)
  Top 0.254: IC3.14 25.14,24.03 28.37,27.25 66.16,27.25 v66.42,27.51 | v88.39,27.38 IC9.10 91.94,27.38 92.34,27.78 R70.2
  Bottom 0.254: v66.42,27.51 66.8,27.89 70.22,27.89 71.88,26.24 74.54,26.24 75.69,27.38 v88.39,27.38
IN3  (via drill 0.5)
  Top 0.254: IC3.12 27.68,24.03 30.4,26.75 67.18,26.75 v67.43,27 | v88.39,26.11 IC9.9 91.81,26.11 92.69,26.98 R70.3
  Bottom 0.254: v67.43,27 67.81,27.38 69.46,27.38 70.22,26.62 70.22,24.71 71.24,23.7 74.67,23.7 76.45,25.48 79.88,25.48 80.51,26.11 v88.39,26.11
IN4  (via drill 0.5)
  Top 0.254: IC3.10 30.22,24.03 32.43,26.24 68.19,26.24 v68.45,26.49 | v88.39,24.84 IC9.8 91.69,24.84 93.03,26.18 R70.4
  Bottom 0.254: v68.45,26.49 68.45,24.59 71.88,21.16 74.67,21.16 77.97,24.46 88,24.46 v88.39,24.84
IN5  (via drill 0.5)
  Top 0.254: IC4.16 35.17,24.03 36.88,25.73 68.95,25.73 72,28.78 v74.42,28.78 | R46.4 77.47,28.65 78.73,29.92 IC9.13
  Top 0.305: v82.16,29.92 IC9.13
  Bottom 0.254: v82.16,29.92 75.56,29.92 v74.42,28.78
IN6  (via drill 0.5)
  Top 0.254: IC4.14 37.71,24.03 38.91,25.22 70.48,25.22 71.5,26.24 74.03,26.24 74.42,26.62 v74.42,27.13 | R46.3 78.12,27.27 78.67,27.83 v78.67,28.08 78.67,28.33 78.99,28.65 IC9.14
  Bottom 0.254: v74.42,27.13 75.37,28.08 v78.67,28.08
IN7  (via drill 0.5)
  Top 0.254: IC4.12 40.25,24.03 40.94,24.71 70.22,24.71 71.24,23.7 73.53,23.7 74.54,24.71 v74.54,24.84 | R46.2 78.46,26.47 v78.61,26.62 79.37,27.38 IC9.15
  Bottom 0.254: v74.54,24.84 76.32,26.62 v78.61,26.62
IN8  (via drill 0.5)
  Top 0.254: IC4.10 42.79,23.7 43.3,24.21 69.97,24.21 70.61,23.57 70.61,22.43 71.88,21.16 73.53,21.16 74.54,22.17 v74.54,22.94 | v82.29,25.35 81.53,26.11 IC9.16 79.11,26.11 78.68,25.67 R46.1
  Bottom 0.254: v74.54,22.94 75.18,22.94 77.21,24.97 80.26,24.97 80.64,25.35 v82.29,25.35
IN9  (via drill 0.5)
  Top 0.254: IC5.16 47.75,20.9 50.54,18.11 69.72,18.11 71.24,16.59 75.31,16.59 v77.59,18.87 | v82.29,20.9 82.16,21.03 IC9.20 78.61,21.03 78.16,21.48 R52.1
  Bottom 0.254: v82.29,20.9 79.62,20.9 v77.59,18.87
IN10  (via drill 0.5)
  Top 0.254: IC5.14 50.29,21.03 52.7,18.62 70.22,18.62 71.62,17.22 74.54,17.22 76.11,18.79 v76.45,18.79 | v82.42,22.05 81.66,22.05 81.4,22.3 IC9.19 80.24,22.28 R52.2
  Bottom 0.254: v82.42,22.05 79.7,22.05 v76.45,18.79
IN11  (via drill 0.5)
  Top 0.254: IC5.12 52.83,21.03 54.73,19.13 70.61,19.13 71.88,17.86 73.91,17.86 75.11,19.06 v75.24,19.06 | v81.78,22.94 81.78,23.32 81.53,23.57 IC9.18 78.99,23.57 78.5,23.08 R52.3
  Bottom 0.254: v81.78,22.94 79.11,22.94 v75.24,19.06
IN12
  Top 0.254: IC5.10 55.37,21.41 57.14,19.63 70.99,19.63 72.13,18.49 73.53,18.49 75.56,20.52 76.07,20.52 76.58,21.03 76.58,23.7 76.76,23.88 R52.4 78.16,23.88 79.11,24.84 IC9.17
IN13  (via drill 0.5)
  Top 0.254: IC6.16 v60.32,21.03 | v88.39,19.76 IC9.4 91.56,19.76 93.59,21.79 R73.4
  Bottom 0.254: v60.32,21.03 64.76,16.59 85.21,16.59 v88.39,19.76
IN14  (via drill 0.5)
  Top 0.254: IC6.14 v62.86,21.03 | v88.39,21.03 IC9.5 91.56,21.03 92.58,22.05 92.58,22.81 92.94,23.17 R73.3
  Bottom 0.254: v62.86,21.03 66.8,17.09 84.45,17.09 v88.39,21.03
IN15  (via drill 0.5)
  Top 0.254: IC6.12 v65.4,21.03 | v88.39,22.3 IC9.6 91.56,22.3 92.07,22.81 92.07,23.19 92.85,23.97 R73.2
  Bottom 0.254: v65.4,21.03 68.83,17.6 83.69,17.6 v88.39,22.3
IN16  (via drill 0.5)
  Top 0.254: IC6.10 v67.94,21.03 | v88.39,23.57 IC9.7 91.56,23.57 92.76,24.77 R73.1
  Bottom 0.254: v67.94,21.03 70.86,18.11 82.92,18.11 v88.39,23.57
LED1
  Top 0.254: U2.G5 R53.1
LED_RED  (via drill 0.5)
  Top 0.254: v85.34,23.7 85.34,32.21 91.81,38.68 91.81,41.99 92.58,42.75 R53.2 | v27.68,56.84 27.68,57.61 28.19,58.12 29.11,58.12 LED1.A
  Bottom 0.254: v85.34,23.7 78.73,23.7 73.65,18.62 71.75,18.62 65.91,24.46 62.99,24.46 56.76,30.68 56.76,55.07 54.98,56.84 v27.68,56.84
N$1
  Top 0.254: 12.58,13.73 R71.8
  Top 0.305: IC2.1 10.03,15.44 10.54,14.94 12.06,14.94 12.64,14.36 R71.8 | D3.2 12.58,13.73
N$2
  Top 0.254: 13.46,13.65 R71.7
  Top 0.305: IC2.3 12.57,15.44 13.44,14.57 R71.7 | D3.1 11.38,11.83 12.33,12.78 13.2,12.78 13.46,13.03 13.46,13.65
N$3
  Top 0.254: Q1.2 43.2,69.19 42.67,68.66 41.65,68.66 41.16,68.17 R15.6
N$4
  Top 0.254: R15.5 41.96,67.95 42.16,68.15 44.83,68.15 45.74,69.06 Q1.4
N$5
  Top 0.305: IC2.5 15.11,15.44 14.24,14.57 R71.6 14.24,13.01 14.47,12.78 15.34,12.78 16.29,11.83 D2.2
N$6
  Top 0.254: 17,13.67 D2.1
  Top 0.305: IC2.7 17.65,15.32 17.27,14.94 15.62,14.94 15.04,14.36 R71.5 17,13.67
N$7
  Top 0.254: 25.15,13.73 R11.8
  Top 0.305: R11.8 25.21,14.36 24.63,14.94 22.98,14.94 22.6,15.32 IC3.1 | D5.2 25.15,13.73
N$8
  Top 0.254: Q5.4 15.26,67.48 R2.5
N$9
  Top 0.254: Q5.2 12.72,67.43 R2.8
N$10
  Top 0.254: 29.57,13.67 D6.1
  Top 0.305: IC3.7 30.22,15.32 29.84,14.94 28.19,14.94 27.61,14.36 R11.5 29.57,13.67
N$11
  Top 0.254: 26.03,13.65 R11.7
  Top 0.305: IC3.3 25.14,15.44 26.01,14.57 R11.7 | D5.1 23.94,11.83 24.89,12.78 25.77,12.78 26.03,13.03 26.03,13.65
N$12
  Top 0.305: IC3.5 27.68,15.44 26.81,14.57 R11.6 26.81,13.01 27.05,12.78 27.92,12.78 28.87,11.83 D6.2
N$13
  Top 0.254: 37.72,13.73 R12.8
  Top 0.305: R12.8 37.78,14.36 37.2,14.94 35.55,14.94 35.17,15.32 IC4.1 | D7.2 37.72,13.73
N$14
  Top 0.305: IC4.3 37.71,15.44 38.58,14.57 R12.7 38.58,13.01 38.35,12.78 37.46,12.78 36.51,11.83 D7.1
N$15
  Top 0.305: IC4.5 40.25,15.44 39.38,14.57 R12.6 39.38,13.01 39.62,12.78 40.49,12.78 41.44,11.83 D8.2
N$16
  Top 0.305: IC4.7 42.79,15.32 42.41,14.94 40.76,14.94 40.18,14.36 R12.5 42.14,13.67 D8.1
N$17
  Top 0.305: IC5.5 52.83,15.44 51.96,14.57 R21.6 51.96,13.01 52.19,12.78 54.2,12.78 54.52,12.46 D12.2
N$18
  Top 0.254: R21.5 54.46,13.67 D12.1
  Top 0.305: R21.5 52.76,14.36 52.95,14.55 54.6,14.55 55.37,15.32 IC5.7
N$19
  Top 0.305: IC5.3 50.29,15.44 51.16,14.57 R21.7 51.16,13.01 50.92,12.78 50.03,12.78 49.08,11.83 D9.1
N$20
  Top 0.254: 50.3,13.73 R21.8
  Top 0.305: R21.8 50.36,14.36 49.78,14.94 48.13,14.94 47.75,15.32 IC5.1 | D9.2 50.3,13.73
N$21
  Top 0.305: IC6.5 65.4,15.44 64.53,14.57 R22.6 64.53,13.01 64.76,12.78 67.56,12.78 67.98,12.35 D11.2
N$22
  Top 0.305: IC6.7 67.94,15.32 67.18,14.55 65.53,14.55 65.33,14.36 R22.5 67.92,13.67 D11.1
N$23
  Top 0.305: IC6.3 62.86,15.44 63.73,14.57 R22.7 63.73,13.01 63.49,12.78 60.83,12.78 60.53,12.48 D10.1
N$24
  Top 0.305: IC6.1 60.32,15.44 61.21,14.55 62.73,14.55 62.93,14.36 R22.8 62.87,13.73 D10.2
N$28
  Top 0.254: Q2.4 38.12,69.27 38.73,68.66 39.87,68.66 40.36,68.17 R15.7
N$29
  Top 0.254: R15.8 39.56,67.95 39.36,68.15 36.44,68.15 35.58,69.01 Q2.2
N$32
  Top 0.254: R1.5 26.72,67.95 26.92,68.15 29.59,68.15 30.5,69.06 Q3.4
N$33
  Top 0.254: R1.6 25.92,68.17 26.41,68.66 27.43,68.66 27.96,69.19 Q3.2
N$36
  Top 0.254: Q4.4 22.88,69.27 23.49,68.66 24.63,68.66 25.12,68.17 R1.7
N$37
  Top 0.254: Q4.2 20.34,69.01 21.2,68.15 24.12,68.15 24.32,67.95 R1.8
N$40
  Top 0.254: R13.5 81.46,68.46 81.91,68.91 81.93,68.91 Q6.4
N$41
  Top 0.254: Q6.2 79.39,69.9 80.66,68.64 R13.6
N$44
  Top 0.254: Q7.4 75.33,68.93 75.61,68.66 79.62,68.66 79.88,68.4 79.88,67.79 R13.7
N$45
  Top 0.254: Q7.2 72.79,68.88 73.65,68.02 78.99,68.02 79.06,67.95 R13.8
N$48
  Top 0.254: R14.5 63.93,67.95 64.13,68.15 66.8,68.15 67.71,69.06 Q8.4
N$49
  Top 0.254: R14.6 63.13,68.17 63.62,68.66 64.76,68.66 65.17,69.06 Q8.2
N$52
  Top 0.254: Q9.4 60.09,69.14 60.57,68.66 61.84,68.66 62.33,68.17 R14.7
N$53
  Top 0.254: R14.8 61.53,67.95 61.34,68.15 58.41,68.15 57.52,69.04 57.52,70.26 Q9.2
N$67
  Top 0.559: IC1.5 8.38,59.89 7.43,58.94 C2.2 7.43,57.29 7.74,56.97 11.68,56.97 12.4,57.69 L3.2
N$68
  Top 0.559: IC1.6 C2.1
OUT1  (via drill 0.5)
  Top 0.254: IC8.11 89.78,60.66 v88.39,62.05 | R13.4 81.46,65.16 v81.02,64.72
  Bottom 0.254: v81.02,64.72 81.27,64.47 85.21,64.47 87.5,62.18 88.26,62.18 v88.39,62.05
OUT2  (via drill 0.5)
  Top 0.254: IC8.10 89.78,59.38 v88.39,60.78 | R13.3 80.66,65.37 v80,64.72
  Bottom 0.254: v80,64.72 80.77,63.96 84.58,63.96 87.75,60.78 v88.39,60.78
OUT3  (via drill 0.5)
  Top 0.254: IC8.9 89.78,58.12 v88.39,59.51 | v78.99,64.72 79.86,65.59 R13.2
  Bottom 0.254: v78.99,64.72 80.26,63.45 84.07,63.45 88,59.51 v88.39,59.51
OUT4  (via drill 0.5)
  Top 0.254: IC8.8 89.78,56.84 v88.39,58.24 | R13.1 79.06,65.8 v77.97,64.72
  Bottom 0.254: v77.97,64.72 79.75,62.94 83.18,62.94 87.88,58.24 v88.39,58.24
OUT5
  Top 0.254: IC8.13 77.97,61.93 75.31,64.59 75.31,66.12 73.91,67.51 72,67.51 70.86,66.37 70.86,64.72 69.84,63.7 64.76,63.7 63.93,64.53 R14.4
OUT6
  Top 0.254: IC8.14 78.23,60.66 74.8,64.08 74.8,65.86 73.65,67 72.26,67 71.37,66.12 71.37,64.47 70.1,63.2 64.51,63.2 63.13,64.57 R14.3
OUT7
  Top 0.254: IC8.15 78.61,59.38 73.65,64.34 72,64.34 70.35,62.69 64.26,62.69 62.33,64.61 R14.2
OUT8
  Top 0.254: IC8.16 77.34,58.12 73.65,61.8 71.62,61.8 71.24,62.18 64,62.18 61.53,64.65 R14.1
OUT9
  Top 0.254: IC8.17 76.32,56.84 73.91,59.26 72.38,59.26 69.97,61.67 43.94,61.67 41.96,63.65 R15.4
OUT10
  Top 0.254: IC8.18 75.31,55.58 74.16,56.72 72.13,56.72 71.24,57.61 71.24,59.64 69.72,61.16 43.68,61.16 41.16,63.68 R15.3
OUT11  (via drill 0.5)
  Top 0.254: v68.95,60.27 68.57,60.66 43.43,60.66 40.36,63.72 R15.2 | IC8.7 89.66,55.58 88.39,56.84 v88.39,56.97
  Bottom 0.254: v88.39,56.97 88.13,56.97 82.67,62.43 76.58,62.43 74.67,64.34 70.99,64.34 68.95,62.31 v68.95,60.27
OUT12  (via drill 0.5)
  Top 0.254: v68.95,59 67.81,60.15 43.17,60.15 39.56,63.76 R15.1 | v88.39,55.7 88.39,54.94 89.02,54.3 IC8.6
  Bottom 0.254: v68.95,59 71.75,61.8 82.29,61.8 v88.39,55.7
OUT13  (via drill 0.5)
  Top 0.254: v68.95,57.86 67.18,59.64 40.89,59.64 36.06,64.47 27.05,64.47 26.72,64.79 R1.4 | IC8.5 89.28,53.04 87.24,55.07 v87.24,55.7
  Bottom 0.254: v68.95,57.86 70.35,59.26 83.69,59.26 v87.24,55.7
OUT14  (via drill 0.5)
  Top 0.254: v68.95,56.72 66.54,59.13 40.63,59.13 35.81,63.96 26.79,63.96 25.92,64.83 R1.3 | IC8.4 89.15,51.77 88,52.91 88,53.29 86.1,55.19 v86.1,55.7
  Bottom 0.254: v86.1,55.7 85.08,56.72 v68.95,56.72
OUT15
  Top 0.254: IC8.19 80.13,54.18 70.1,54.18 65.65,58.62 40.38,58.62 35.55,63.45 26.54,63.45 25.12,64.86 R1.2
OUT16
  Top 0.254: IC8.20 77.08,53.04 75.69,51.64 71.88,51.64 65.4,58.12 40.13,58.12 35.3,62.94 26.28,62.94 24.32,64.9 R1.1
PAIR1_N
  Bottom 0.254: U2.G26 72.1,43.54 arc45 70.95,44.02 67.73,44.02 arc-45 65.94,44.76 U3.RX1
PAIR1_P
  Bottom 0.254: U3.RX0 72.87,45.27 U2.G25
PAIR2_N
  Bottom 0.254: U2.G22 90.15,52.38 arc-45 88.35,51.64 70.32,51.64 arc45 68.52,50.89 U3.TX1
PAIR2_P
  Bottom 0.254: U2.G19 97.77,47.3 arc-45 95.97,46.56 67.73,46.56 arc-45 65.94,47.3 U3.TX0
PWM1  (via drill 0.5)
  Top 0.254: v80.13,32.33 80.13,40.21 73.78,46.56 71.75,46.56 70.99,47.32 70.99,51.77 65.14,57.61 39.87,57.61 35.05,62.43 25.77,62.43 23.74,64.46 15.62,64.46 15.16,64.92 R2.4
  Bottom 0.254: v80.13,32.33 96.01,32.33 U2.G2
PWM2  (via drill 0.5)
  Top 0.254: v79.24,37.92 79.24,40.46 75.69,44.02 71.37,44.02 70.35,45.03 70.35,51.64 64.89,57.1 39.62,57.1 34.79,61.93 25.39,61.93 23.36,63.96 13.71,63.96 12.76,64.9 R2.1 | v93.85,35.13 U2.G4
  Bottom 0.254: v93.85,35.13 91.05,37.92 v79.24,37.92
S0-1  (via drill 0.5)
  Top 0.254: IC2.16 10.03,24.08 15.74,29.79 61.72,29.79 v62.1,30.18 | R24.2 75.2,39.21 73.65,37.67 U2.G14
  Bottom 0.254: v62.1,30.18 65.27,33.35 68.57,33.35 U2.G14
S0-2  (via drill 0.5)
  Top 0.254: IC2.14 12.57,24.03 17.82,29.29 62.73,29.29 v63.11,29.67 | v92.45,33.73 92.45,35.38 94.74,37.67 U2.G16 | R24.4 76.07,34.49 v76.7,33.86
  Bottom 0.254: v63.11,29.67 66.16,32.71 69.34,32.71 70.48,33.86 v76.7,33.86 92.32,33.86 v92.45,33.73
S0-3  (via drill 0.5)
  Top 0.254: IC2.12 15.11,24.03 19.86,28.78 63.75,28.78 v64.13,29.16 | R24.3 75.41,38.41 75.18,38.18 75.18,34.24 76.83,32.59 v76.83,32.08
  Bottom 0.254: v64.13,29.16 66.29,31.32 76.83,31.32 | U2.G15 94.48,31.32 76.83,31.32 | v76.83,32.08 76.83,31.32
S0-4
  Top 0.254: IC2.10 17.65,24.03 21.89,28.27 64.38,28.27 65.27,29.16 67.56,29.16 | U2.G13 72.13,30.05 71.24,29.16 67.56,29.16 | R24.1 74.98,40.01 73.91,38.94 72,38.94 69.46,36.4 67.6,36.4 66.67,35.47 66.67,33.73 67.56,32.84 67.56,29.16
SCL  (via drill 0.5)
  Top 0.254: IC7.7 86.61,67.13 87.75,65.99 87.75,63.07 83.43,58.75 83.43,51 v82.92,50.5 83.43,49.99 83.43,19.63 82.29,18.49 IC9.22 79.11,18.49 76.7,16.08 76.7,14.05 76.18,13.52 R45.1 | U2.G32 73.02,50.5 IC8.22
  Bottom 0.254: U2.G32 82.8,50.37 v82.92,50.5
SCL_X
  Top 0.254: R48.1 88.26,79.85 CON2.3
  Top 0.305: R48.1 89.85,75.83 90.36,75.32 D4.1 90.36,72.28 87.75,69.67 IC7.5 IC7.6
SDA  (via drill 0.5)
  Top 0.254: IC7.1 90.57,65.25 83.94,58.62 83.94,48.34 v84.32,47.95 83.94,47.57 83.94,18.87 82.29,17.22 IC9.23 79.11,17.22 77.97,16.08 R47.1 | IC8.23 77.59,49.23 76.19,47.83 U2.G33
  Bottom 0.254: v84.32,47.95 73.02,47.95 U2.G33
SDA_X
  Top 0.254: CON2.2 94.36,78.16 R49.1
  Top 0.305: R49.1 92.77,75.83 92.26,75.32 D4.2 92.26,69.1 91.56,68.4 IC7.3 IC7.2
VCC
  Top 0.406: CON1.12 3.82,75.35 D1.A

### Text on the board
Bottom: ETH_IO / v3.1 / github.com/pilotak/eth-io
tPlace: - | + | JLCJLCJLCJLC
bPlace: SJ | - | +
tSilk: A2 | A0 | A0 | A1 | A2